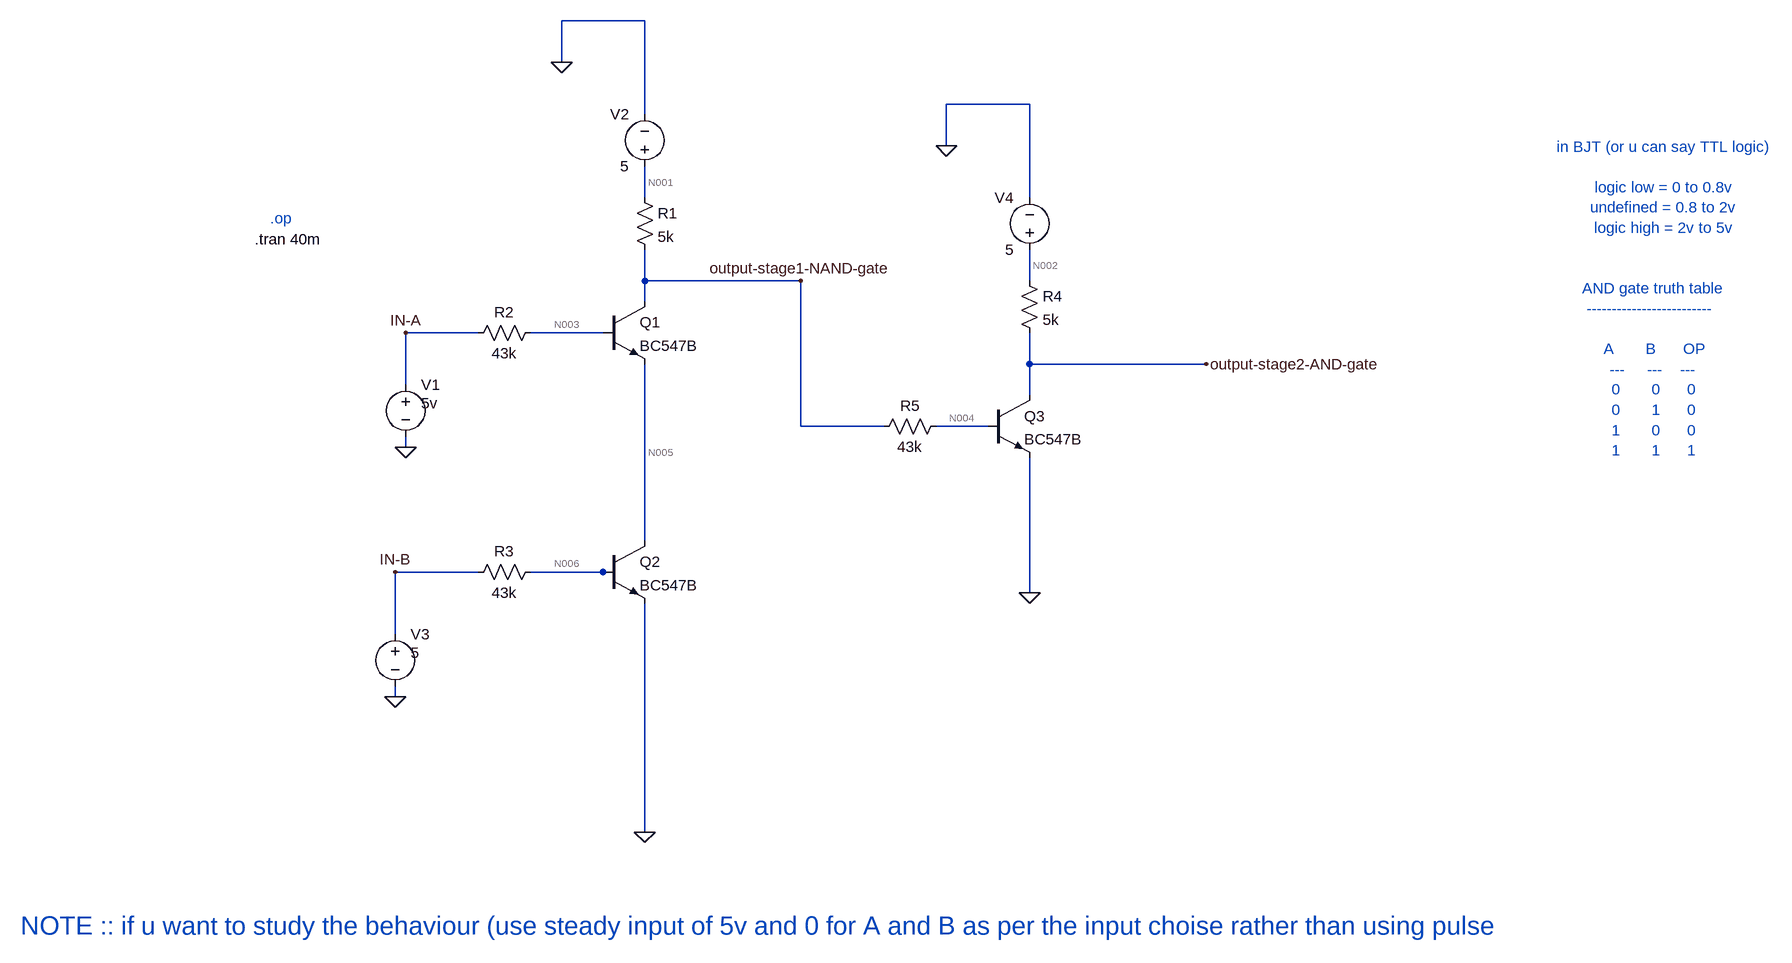
[diagram p0: schematic BJT_as_AND_gate.asc]
BJT_as_AND_gate.asc, the LTspice schematic file:
Version 4.1
SHEET 1 2536 1052
WIRE 352 -368 224 -368
WIRE 224 -304 224 -368
WIRE 944 -240 816 -240
WIRE 352 -224 352 -368
WIRE 816 -176 816 -240
WIRE 352 -96 352 -144
WIRE 944 -96 944 -240
WIRE 352 32 352 -16
WIRE 592 32 352 32
WIRE 944 32 944 -16
WIRE 352 64 352 32
WIRE 96 112 -16 112
WIRE 288 112 176 112
WIRE 944 160 944 112
WIRE 1216 160 944 160
WIRE -16 192 -16 112
WIRE 944 208 944 160
WIRE 592 256 592 32
WIRE 720 256 592 256
WIRE 880 256 800 256
WIRE -16 288 -16 272
WIRE 352 432 352 160
WIRE 96 480 -32 480
WIRE 288 480 176 480
WIRE 304 480 288 480
WIRE 944 512 944 304
WIRE -32 576 -32 480
WIRE -32 672 -32 656
WIRE 352 880 352 528
FLAG -16 112 IN-A
FLAG -16 288 0
FLAG -32 672 0
FLAG -32 480 IN-B
FLAG 352 880 0
FLAG 224 -304 0
FLAG 816 -176 0
FLAG 944 512 0
FLAG 592 32 output-stage1-NAND-gate
FLAG 1216 160 output-stage2-AND-gate
SYMBOL voltage -16 176 R0
WINDOW 3 24 44 Left 2
WINDOW 123 0 0 Left 0
WINDOW 39 0 0 Left 0
SYMATTR Value 5v
SYMATTR InstName V1
SYMBOL npn 288 64 R0
SYMATTR InstName Q1
SYMATTR Value BC547B
SYMBOL voltage 352 -128 R180
WINDOW 0 24 96 Left 2
WINDOW 3 24 16 Left 2
WINDOW 123 0 0 Left 0
WINDOW 39 0 0 Left 0
SYMATTR InstName V2
SYMATTR Value 5
SYMBOL res 336 -112 R0
SYMATTR InstName R1
SYMATTR Value 5k
SYMBOL res 192 96 R90
WINDOW 0 0 56 VBottom 2
WINDOW 3 32 56 VTop 2
SYMATTR InstName R2
SYMATTR Value 43k
SYMBOL npn 288 432 R0
SYMATTR InstName Q2
SYMATTR Value BC547B
SYMBOL voltage -32 560 R0
WINDOW 3 24 44 Left 2
WINDOW 123 0 0 Left 0
WINDOW 39 0 0 Left 0
SYMATTR Value 5
SYMATTR InstName V3
SYMBOL res 192 464 R90
WINDOW 0 0 56 VBottom 2
WINDOW 3 32 56 VTop 2
SYMATTR InstName R3
SYMATTR Value 43k
SYMBOL npn 880 208 R0
SYMATTR InstName Q3
SYMATTR Value BC547B
SYMBOL voltage 944 0 R180
WINDOW 0 24 96 Left 2
WINDOW 3 24 16 Left 2
WINDOW 123 0 0 Left 0
WINDOW 39 0 0 Left 0
SYMATTR InstName V4
SYMATTR Value 5
SYMBOL res 928 16 R0
SYMATTR InstName R4
SYMATTR Value 5k
SYMBOL res 816 240 R90
WINDOW 0 0 56 VBottom 2
WINDOW 3 32 56 VTop 2
SYMATTR InstName R5
SYMATTR Value 43k
TEXT -248 -32 Left 2 !.tran 40m
TEXT -224 -64 Left 2 ;.op
TEXT 1920 -112 Center 2 ;in BJT (or u can say TTL logic)\n \nlogic low = 0 to 0.8v\nundefined = 0.8 to 2v\nlogic high = 2v to 5v
TEXT 1904 168 Center 2 ;AND gate truth table\n-------------------------\n \nA       B      OP\n---     ---    ---\n0       0      0\n0       1      0\n1       0      0\n1       1      1
TEXT -608 1024 Left 4 ;NOTE :: if u want to study the behaviour (use steady input of 5v and 0 for A and B as per the input choise rather than using pulse

The netlist it stands for:
* BJT_as_AND_gate.asc
V1 IN-A 0 5v
Q1 output-stage1-NAND-gate N003 N005 0 BC547B
V2 N001 0 5
R1 N001 output-stage1-NAND-gate 5k
R2 N003 IN-A 43k
Q2 N005 N006 0 0 BC547B
V3 IN-B 0 5
R3 N006 IN-B 43k
Q3 output-stage2-AND-gate N004 0 0 BC547B
V4 N002 0 5
R4 N002 output-stage2-AND-gate 5k
R5 N004 output-stage1-NAND-gate 43k
.model NPN NPN
.model PNP PNP
.lib standard.bjt
.tran 40m
* .op
* in BJT (or u can say TTL logic)
* logic low = 0 to 0.8v
* undefined = 0.8 to 2v
* logic high = 2v to 5v
* AND gate truth table
* -------------------------
* A       B      OP
* ---     ---    ---
* 0       0      0
* 0       1      0
* 1       0      0
* 1       1      1
* NOTE :: if u want to study the behaviour (use steady input of 5v and 0 for A and B as per the input choise rather than using pulse
.backanno
.end

* Results of the author's LTspice run, read from the files saved beside the schematic
* Operating Point, zero values left out:
*   V(output-stage1-nand-gate) = 63.67 mV
*   V(n005) = 32.64 mV
*   V(n001) = 5 V
*   V(in-b) = 5 V
*   V(n002) = 5 V
*   V(in-a) = 5 V
*   V(n003) = 685.7 mV
*   V(n006) = 654.6 mV
*   V(output-stage2-and-gate) = 5 V
*   V(n004) = 63.67 mV
*   I(V1) = -100.3 µA
*   I(R2) = -100.3 µA
*   Ic(Q2) = 1.088 mA
*   Ib(Q2) = 101.1 µA
*   Ie(Q2) = -1.189 mA
*   I(R3) = -101.1 µA
*   I(R4) = 5.297 pA
*   I(V2) = -987.3 µA
*   Ic(Q1) = 987.3 µA
*   Ib(Q1) = 100.3 µA
*   Ie(Q1) = -1.088 mA
*   I(R5) = 4.924 pA
*   I(R1) = 987.3 µA
*   I(V3) = -101.1 µA
*   Ic(Q3) = 5.298 pA
*   Ib(Q3) = -4.924 pA
*   I(V4) = -5.297 pA